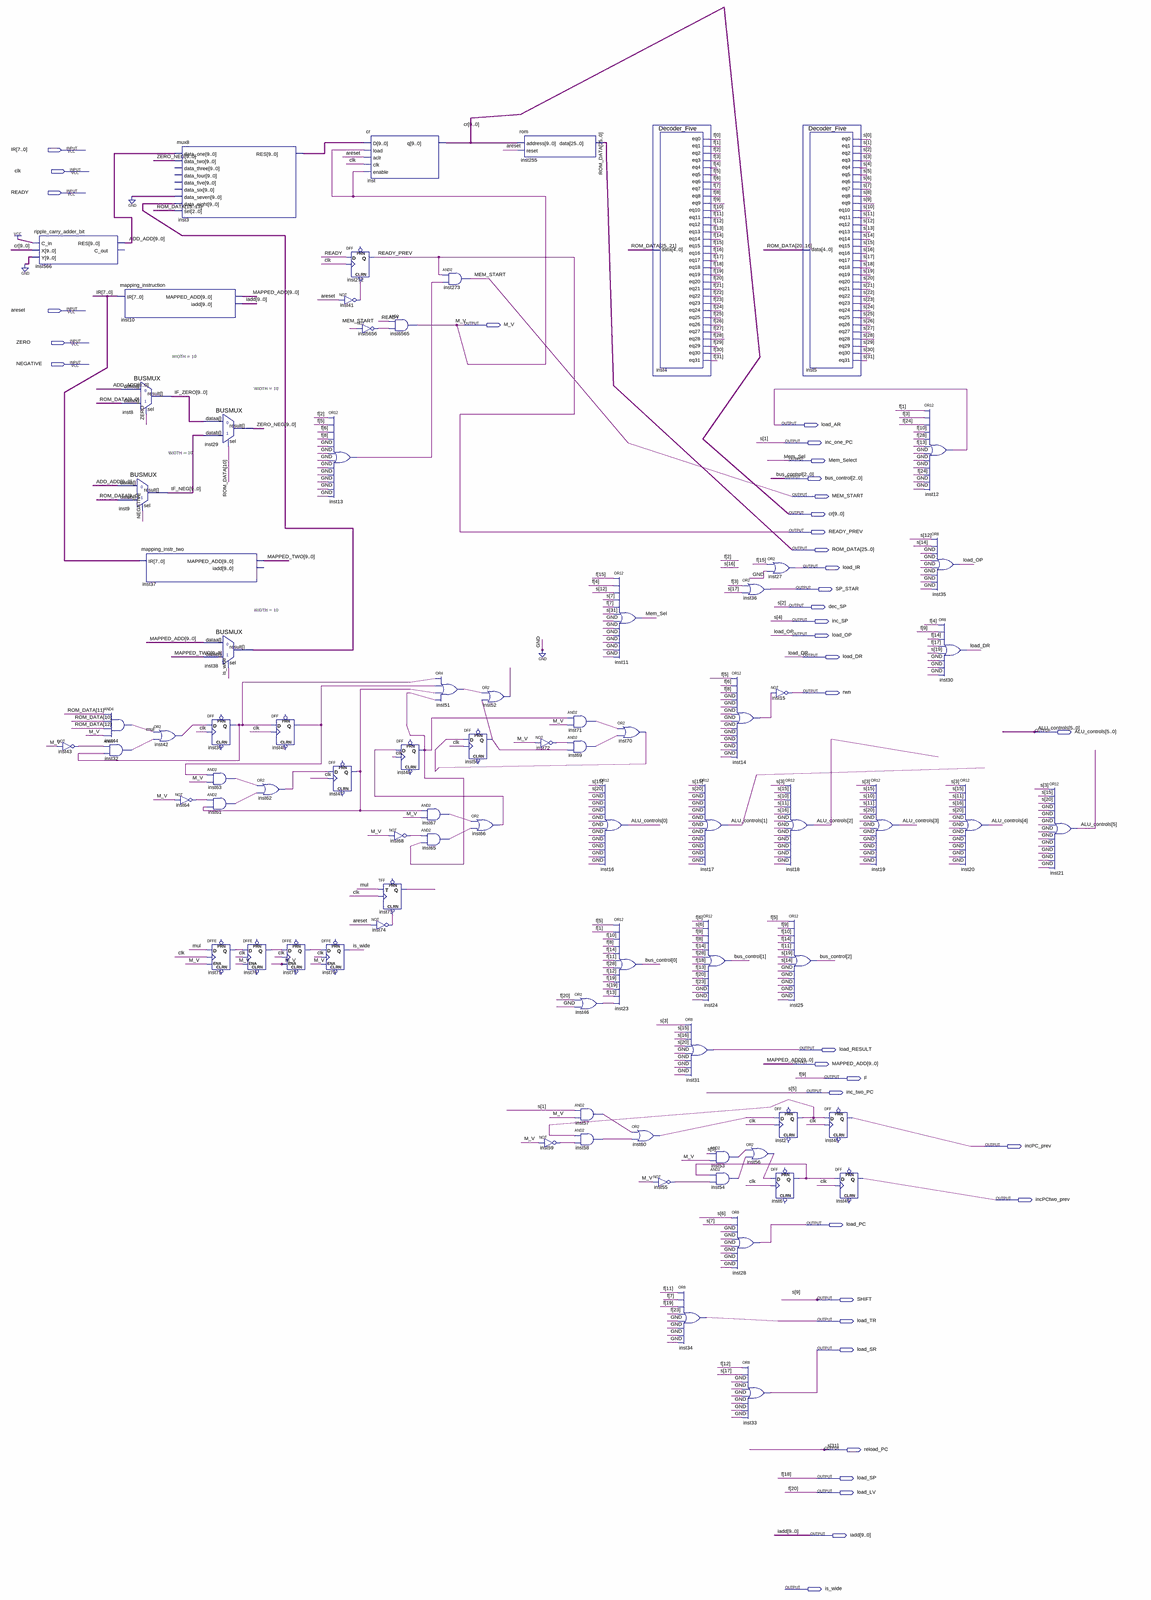
[diagram p0: schematic sheet, whole]
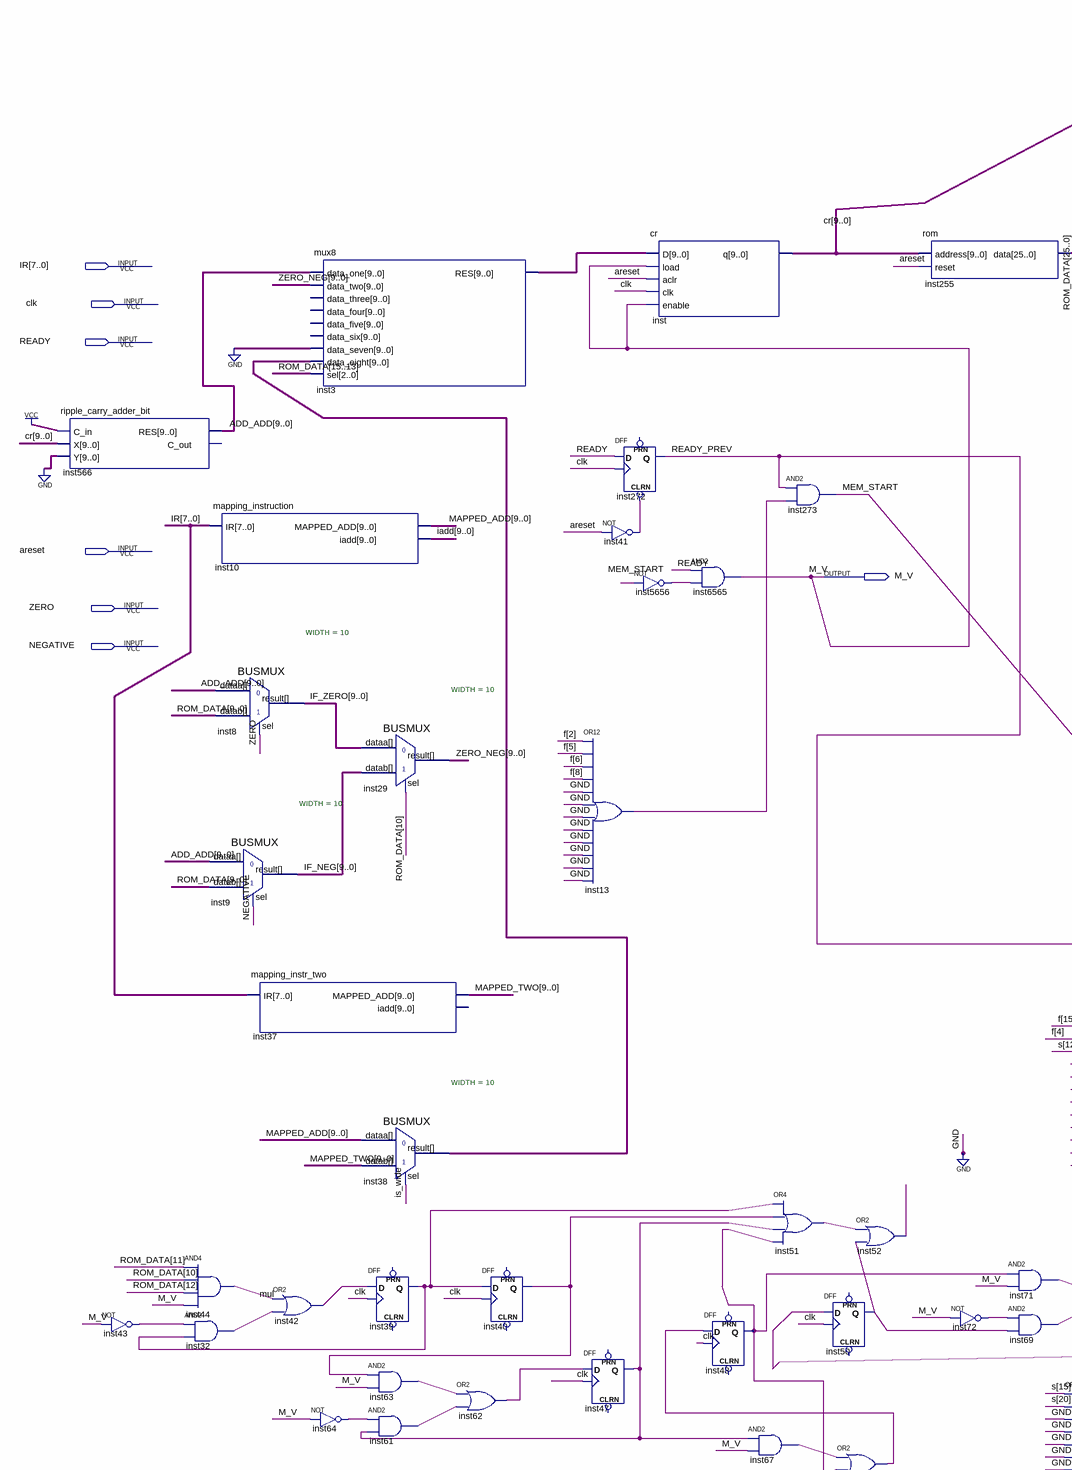
[diagram p1: schematic sheet, upper left part]
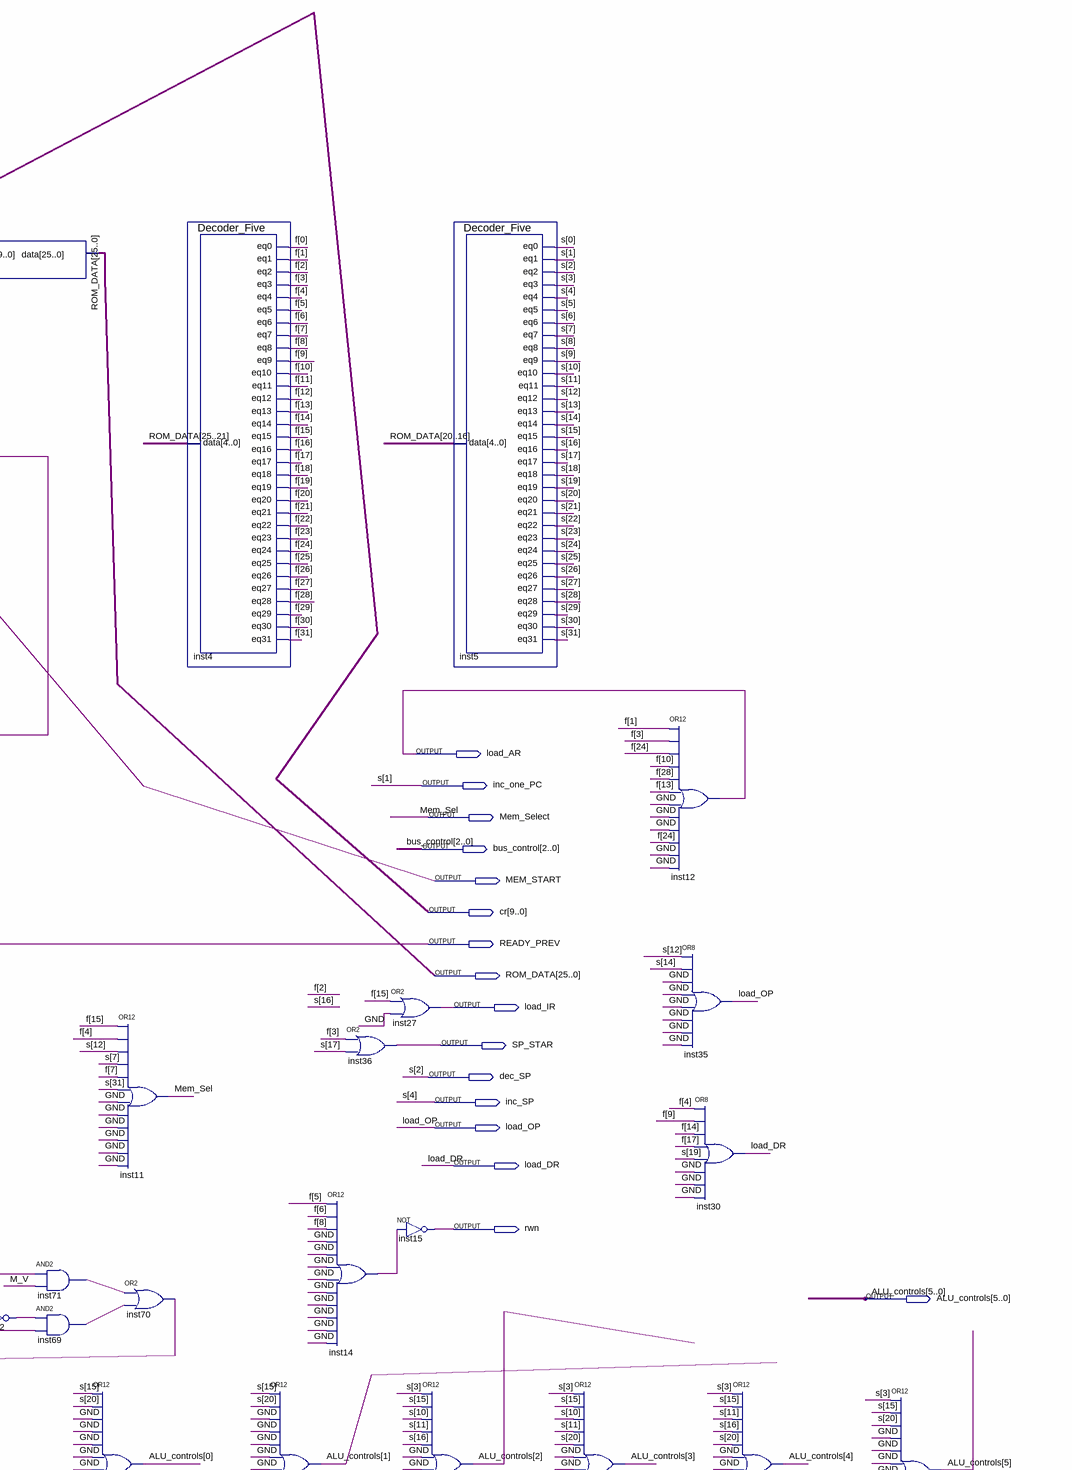
[diagram p2: schematic sheet, upper right part]
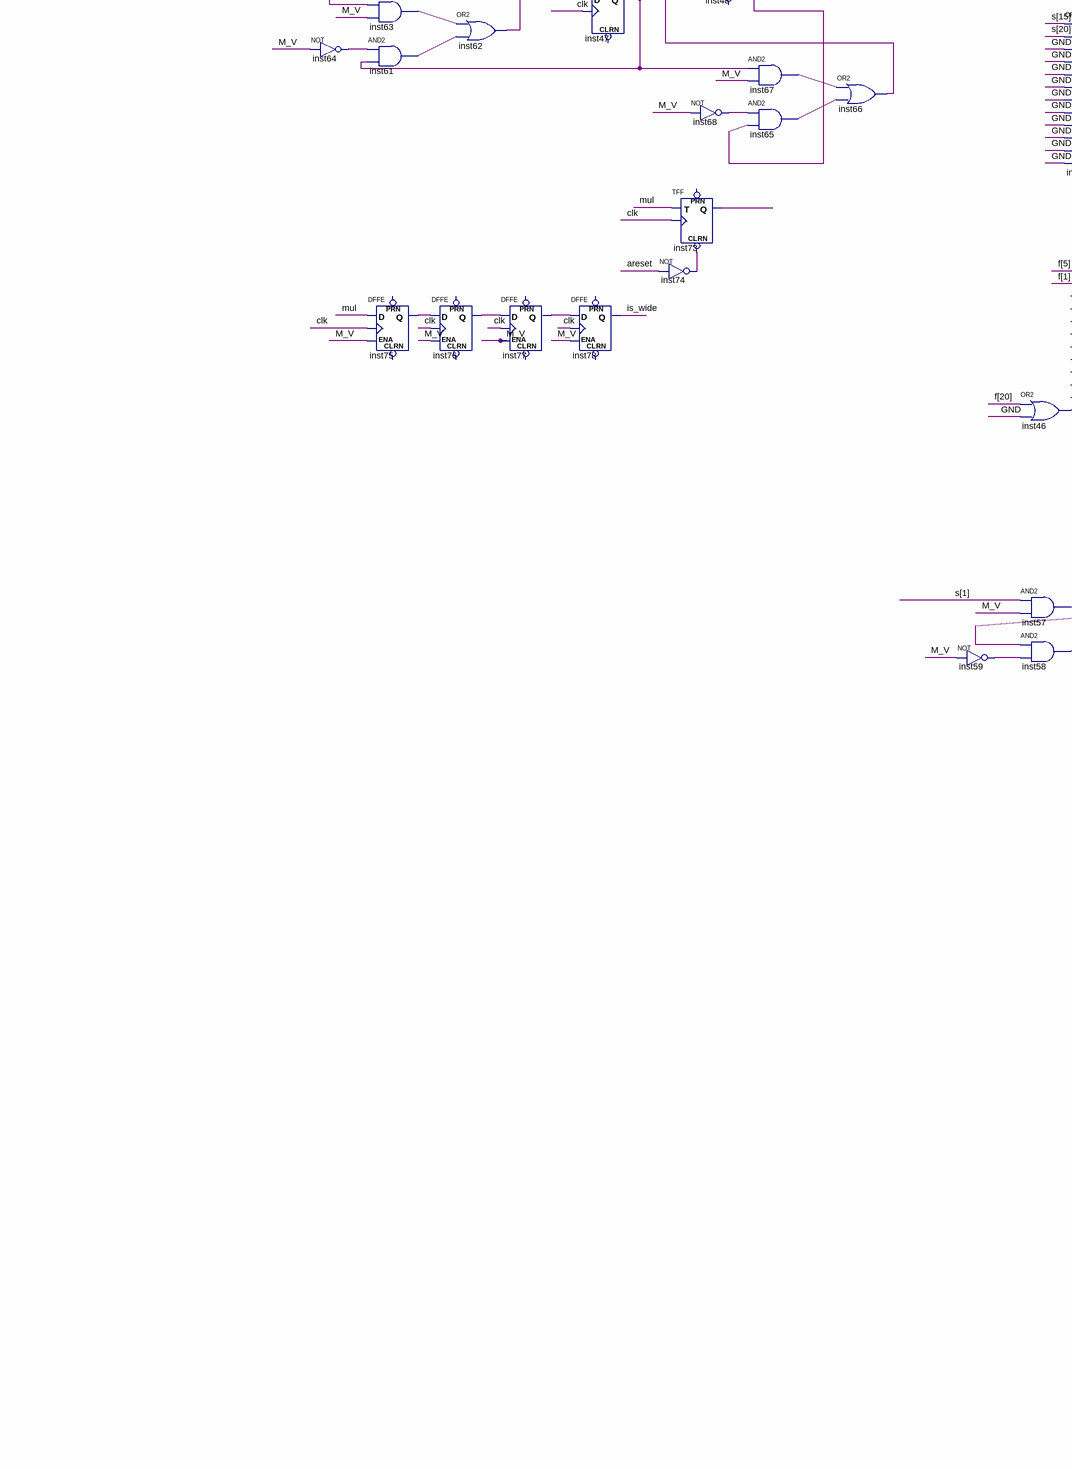
[diagram p3: schematic sheet, lower left part]
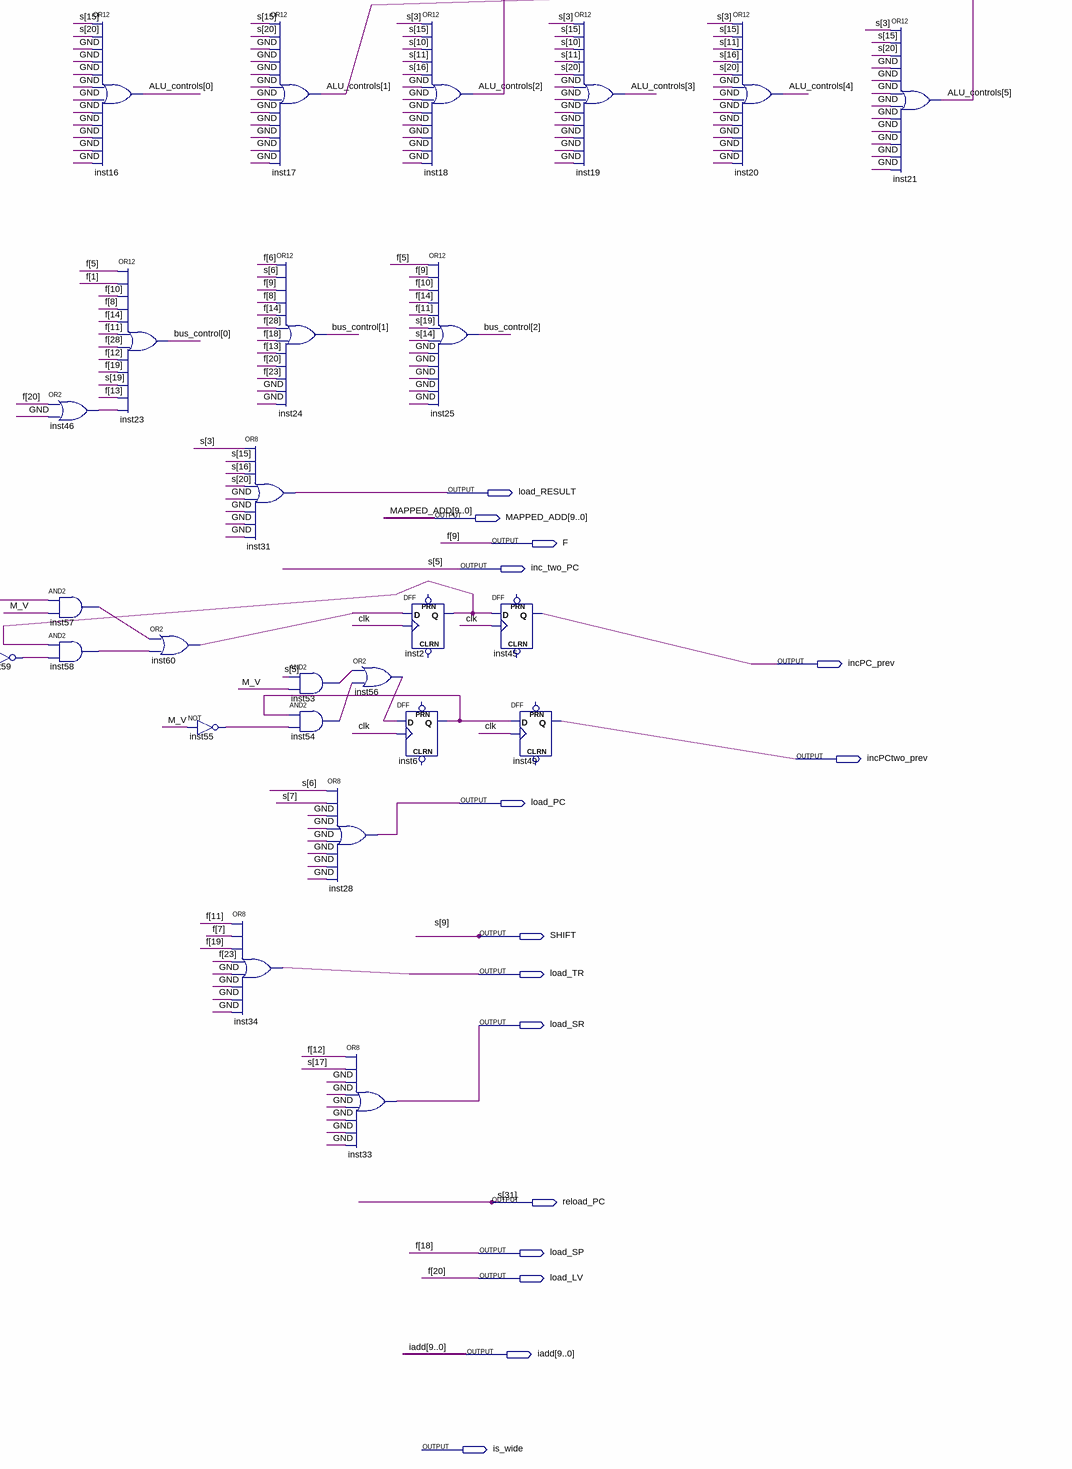
[diagram p4: schematic sheet, lower right part]
// Quartus schematic micro_control.bdf as structural Verilog: 81 symbols, 38 pins
module micro_control (
  input  [7:0] IR,
  input  clk,
  input  READY,
  input  areset,
  input  ZERO,
  input  NEGATIVE,
  output M_V,
  output load_AR,
  output inc_one_PC,
  output Mem_Select,
  output [2:0] bus_control,
  output MEM_START,
  output [9:0] cr,
  output READY_PREV,
  output [25:0] ROM_DATA,
  output load_IR,
  output SP_STAR,
  output dec_SP,
  output inc_SP,
  output load_OP,
  output load_DR,
  output rwn,
  output [5:0] ALU_controls,
  output load_RESULT,
  output [9:0] MAPPED_ADD,
  output F,
  output inc_two_PC,
  output incPC_prev,
  output incPCtwo_prev,
  output load_PC,
  output SHIFT,
  output load_TR,
  output load_SR,
  output reload_PC,
  output load_SP,
  output load_LV,
  output [9:0] iadd,
  output is_wide
);

  wire inst2_q, inst6_q, inst13_out, inst14_out, inst32_out, inst39_q, inst40_q, inst41_out, inst42_out,
       inst43_out, inst46_out, inst47_q, inst48_q, inst50_q, inst51_out, inst52_out, inst53_out, inst54_out,
       inst55_out, inst56_out, inst57_out, inst58_out, inst59_out, inst60_out, inst61_out, inst62_out,
       inst63_out, inst64_out, inst65_out, inst66_out, inst67_out, inst68_out, inst69_out, inst70_out,
       inst71_out, inst72_out, inst73_q, inst74_out, inst75_q, inst76_q, inst77_q, inst5656_out, mul;
  wire [9:0] ADD_ADD, IF_NEG, IF_ZERO, inst3_res, inst38_result, MAPPED_TWO, ZERO_NEG;
  wire [30:0] s;
  wire [31:0] F_bus;

  ripple_carry_adder_bit inst566 (.C_in(1'b1), .X(cr), .Y({10{1'b0}}), .RES(ADD_ADD));  // open: C_out
  not inst43 (inst43_out, M_V);
  mapping_instruction inst10 (.IR(IR), .MAPPED_ADD(MAPPED_ADD), .iadd(iadd));
  BUSMUX #(.WIDTH(10)) inst8 (.datab(ROM_DATA[9:0]), .sel(ZERO), .dataa(ADD_ADD), .result(IF_ZERO));
  BUSMUX #(.WIDTH(10)) inst9 (.datab(ROM_DATA[9:0]), .sel(NEGATIVE), .dataa(ADD_ADD), .result(IF_NEG));
  and inst44 (mul, ROM_DATA[11], ROM_DATA[10], ROM_DATA[12], M_V);
  and inst32 (inst32_out, inst43_out, inst39_q);
  mapping_instr_two inst37 (.IR(IR), .MAPPED_ADD(MAPPED_TWO));  // open: iadd
  mux8 inst3 (
    .data_one(ADD_ADD), .data_two(ZERO_NEG), .data_seven({10{1'b0}}), .data_eight(inst38_result),
    .sel(ROM_DATA[15:13]), .RES(inst3_res));  // open: data_three, data_four, data_five, data_six
  or inst42 (inst42_out, mul, inst32_out);
  not inst64 (inst64_out, M_V);
  BUSMUX #(.WIDTH(10)) inst29 (.datab(IF_NEG), .sel(ROM_DATA[10]), .dataa(IF_ZERO), .result(ZERO_NEG));
  BUSMUX #(.WIDTH(10)) inst38 (.datab(MAPPED_TWO), .sel(is_wide), .dataa(MAPPED_ADD), .result(inst38_result));
  DFF inst39 (.CLK(clk), .D(inst42_out), .Q(inst39_q));  // open: CLRN, PRN
  and inst63 (inst63_out, inst40_q, M_V);
  and inst61 (inst61_out, inst64_out, inst47_q);
  DFFE inst75 (.D(mul), .CLK(clk), .ENA(M_V), .Q(inst75_q));  // open: PRN, CLRN
  or inst62 (inst62_out, inst63_out, inst61_out);
  DFFE inst76 (.D(inst75_q), .CLK(clk), .ENA(M_V), .Q(inst76_q));  // open: PRN, CLRN
  DFF inst40 (.CLK(clk), .D(inst39_q), .Q(inst40_q));  // open: CLRN, PRN
  DFFE inst77 (.D(inst76_q), .CLK(clk), .ENA(M_V), .Q(inst77_q));  // open: PRN, CLRN
  DFFE inst78 (.D(inst77_q), .CLK(clk), .ENA(M_V), .Q(is_wide));  // open: PRN, CLRN
  DFF inst272 (.CLRN(inst41_out), .CLK(clk), .D(READY), .Q(READY_PREV));  // open: PRN
  not inst41 (inst41_out, areset);
  or inst13 (inst13_out, F_bus[2], F_bus[5], F_bus[6], F_bus[8], 1'b0, 1'b0, 1'b0, 1'b0, 1'b0, 1'b0, 1'b0, 1'b0);
  DFF inst47 (.CLK(clk), .D(inst62_out), .Q(inst47_q));  // open: CLRN, PRN
  cr inst (.D(inst3_res), .load(M_V), .aclr(areset), .clk(clk), .enable(M_V), .q(cr));
  not inst5656 (inst5656_out, MEM_START);
  TFF inst73 (.CLRN(inst74_out), .T(mul), .CLK(clk), .Q(inst73_q));  // open: PRN
  not inst74 (inst74_out, areset);
  and inst6565 (M_V, READY, inst5656_out);
  DFF inst48 (.CLK(clk), .D(inst66_out), .Q(inst48_q));  // open: CLRN, PRN
  not inst68 (inst68_out, M_V);
  or inst51 (inst51_out, inst39_q, inst40_q, inst47_q, inst48_q);
  and inst67 (inst67_out, inst47_q, M_V);
  and inst65 (inst65_out, inst68_out, inst48_q);
  and inst273 (MEM_START, READY_PREV, inst13_out);
  DFF inst50 (.CLK(clk), .D(inst70_out), .Q(inst50_q));  // open: CLRN, PRN
  or inst52 (inst52_out, inst51_out, inst50_q);
  or inst66 (inst66_out, inst67_out, inst65_out);
  rom inst255 (.address(cr), .reset(areset), .data(ROM_DATA));
  not inst72 (inst72_out, M_V);
  not inst59 (inst59_out, M_V);
  and inst71 (inst71_out, inst48_q, M_V);
  and inst69 (inst69_out, inst72_out, inst50_q);
  or inst46 (inst46_out, load_LV, 1'b0);
  and inst57 (inst57_out, inc_one_PC, M_V);
  and inst58 (inst58_out, inst2_q, inst59_out);
  or inst16 (ALU_controls[0], s[15], s[20], 1'b0, 1'b0, 1'b0, 1'b0, 1'b0, 1'b0, 1'b0, 1'b0, 1'b0, 1'b0);
  or inst11 (Mem_Select, F_bus[15], F_bus[4], s[12], s[7], F_bus[7], reload_PC, 1'b0, 1'b0, 1'b0, 1'b0, 1'b0, 1'b0);
  or inst70 (inst70_out, inst71_out, inst69_out);
  or inst23 (bus_control[0], F_bus[5], F_bus[1], F_bus[10], F_bus[8], F_bus[14], F_bus[11], F_bus[28], F_bus[12], F_bus[19], s[19], F_bus[13], inst46_out);
  or inst60 (inst60_out, inst57_out, inst58_out);
  Decoder_Five inst4 (
    .data(ROM_DATA[25:21]), .eq0(F_bus[0]), .eq1(F_bus[1]), .eq2(F_bus[2]), .eq3(F_bus[3]), .eq4(F_bus[4]),
    .eq5(F_bus[5]), .eq6(F_bus[6]), .eq7(F_bus[7]), .eq8(F_bus[8]), .eq9(F), .eq10(F_bus[10]),
    .eq11(F_bus[11]), .eq12(F_bus[12]), .eq13(F_bus[13]), .eq14(F_bus[14]), .eq15(F_bus[15]),
    .eq16(F_bus[16]), .eq17(F_bus[17]), .eq18(load_SP), .eq19(F_bus[19]), .eq20(load_LV), .eq21(F_bus[21]),
    .eq22(F_bus[22]), .eq23(F_bus[23]), .eq24(F_bus[24]), .eq25(F_bus[25]), .eq26(F_bus[26]),
    .eq27(F_bus[27]), .eq28(F_bus[28]), .eq29(F_bus[29]), .eq30(F_bus[30]), .eq31(F_bus[31]));
  not inst55 (inst55_out, M_V);
  or inst31 (load_RESULT, s[3], s[15], s[16], s[20], 1'b0, 1'b0, 1'b0, 1'b0);
  or inst34 (load_TR, F_bus[11], F_bus[7], F_bus[19], F_bus[23], 1'b0, 1'b0, 1'b0, 1'b0);
  or inst17 (ALU_controls[1], s[15], s[20], 1'b0, 1'b0, 1'b0, 1'b0, 1'b0, 1'b0, 1'b0, 1'b0, 1'b0, 1'b0);
  or inst24 (bus_control[1], F_bus[6], s[6], F, F_bus[8], F_bus[14], F_bus[28], load_SP, F_bus[13], load_LV, F_bus[23], 1'b0, 1'b0);
  and inst53 (inst53_out, inc_two_PC, M_V);
  and inst54 (inst54_out, inst6_q, inst55_out);
  or inst36 (SP_STAR, F_bus[3], s[17]);
  or inst14 (inst14_out, F_bus[5], F_bus[6], F_bus[8], 1'b0, 1'b0, 1'b0, 1'b0, 1'b0, 1'b0, 1'b0, 1'b0, 1'b0);
  or inst56 (inst56_out, inst53_out, inst54_out);
  or inst28 (load_PC, s[6], s[7], 1'b0, 1'b0, 1'b0, 1'b0, 1'b0, 1'b0);
  or inst33 (load_SR, F_bus[12], s[17], 1'b0, 1'b0, 1'b0, 1'b0, 1'b0, 1'b0);
  or inst27 (load_IR, F_bus[15], 1'b0);
  not inst15 (rwn, inst14_out);
  DFF inst2 (.CLK(clk), .D(inst60_out), .Q(inst2_q));  // open: CLRN, PRN
  DFF inst6 (.CLK(clk), .D(inst56_out), .Q(inst6_q));  // open: CLRN, PRN
  Decoder_Five inst5 (
    .data(ROM_DATA[20:16]), .eq0(s[0]), .eq1(inc_one_PC), .eq2(dec_SP), .eq3(s[3]), .eq4(inc_SP),
    .eq5(inc_two_PC), .eq6(s[6]), .eq7(s[7]), .eq8(s[8]), .eq9(SHIFT), .eq10(s[10]), .eq11(s[11]),
    .eq12(s[12]), .eq13(s[13]), .eq14(s[14]), .eq15(s[15]), .eq16(s[16]), .eq17(s[17]), .eq18(s[18]),
    .eq19(s[19]), .eq20(s[20]), .eq21(s[21]), .eq22(s[22]), .eq23(s[23]), .eq24(s[24]), .eq25(s[25]),
    .eq26(s[26]), .eq27(s[27]), .eq28(s[28]), .eq29(s[29]), .eq30(s[30]), .eq31(reload_PC));
  or inst18 (ALU_controls[2], s[3], s[15], s[10], s[11], s[16], 1'b0, 1'b0, 1'b0, 1'b0, 1'b0, 1'b0, 1'b0);
  or inst25 (bus_control[2], F_bus[5], F, F_bus[10], F_bus[14], F_bus[11], s[19], s[14], 1'b0, 1'b0, 1'b0, 1'b0, 1'b0);
  DFF inst45 (.CLK(clk), .D(inst2_q), .Q(incPC_prev));  // open: CLRN, PRN
  DFF inst49 (.CLK(clk), .D(inst6_q), .Q(incPCtwo_prev));  // open: CLRN, PRN
  or inst19 (ALU_controls[3], s[3], s[15], s[10], s[11], s[20], 1'b0, 1'b0, 1'b0, 1'b0, 1'b0, 1'b0, 1'b0);
  or inst12 (load_AR, F_bus[1], F_bus[3], F_bus[24], F_bus[10], F_bus[28], F_bus[13], 1'b0, 1'b0, 1'b0, F_bus[24], 1'b0, 1'b0);
  or inst35 (load_OP, s[12], s[14], 1'b0, 1'b0, 1'b0, 1'b0, 1'b0, 1'b0);
  or inst30 (load_DR, F_bus[4], F, F_bus[14], F_bus[17], s[19], 1'b0, 1'b0, 1'b0);
  or inst20 (ALU_controls[4], s[3], s[15], s[11], s[16], s[20], 1'b0, 1'b0, 1'b0, 1'b0, 1'b0, 1'b0, 1'b0);
  or inst21 (ALU_controls[5], s[3], s[15], s[20], 1'b0, 1'b0, 1'b0, 1'b0, 1'b0, 1'b0, 1'b0, 1'b0, 1'b0);

  // Other names for the same wires on the sheet: F (some bits) = {load_LV, load_SP, F}; Mem_Sel = Mem_Select;
  //   s (some bits) = {reload_PC, SHIFT, inc_two_PC, inc_SP, dec_SP, inc_one_PC}
endmodule
